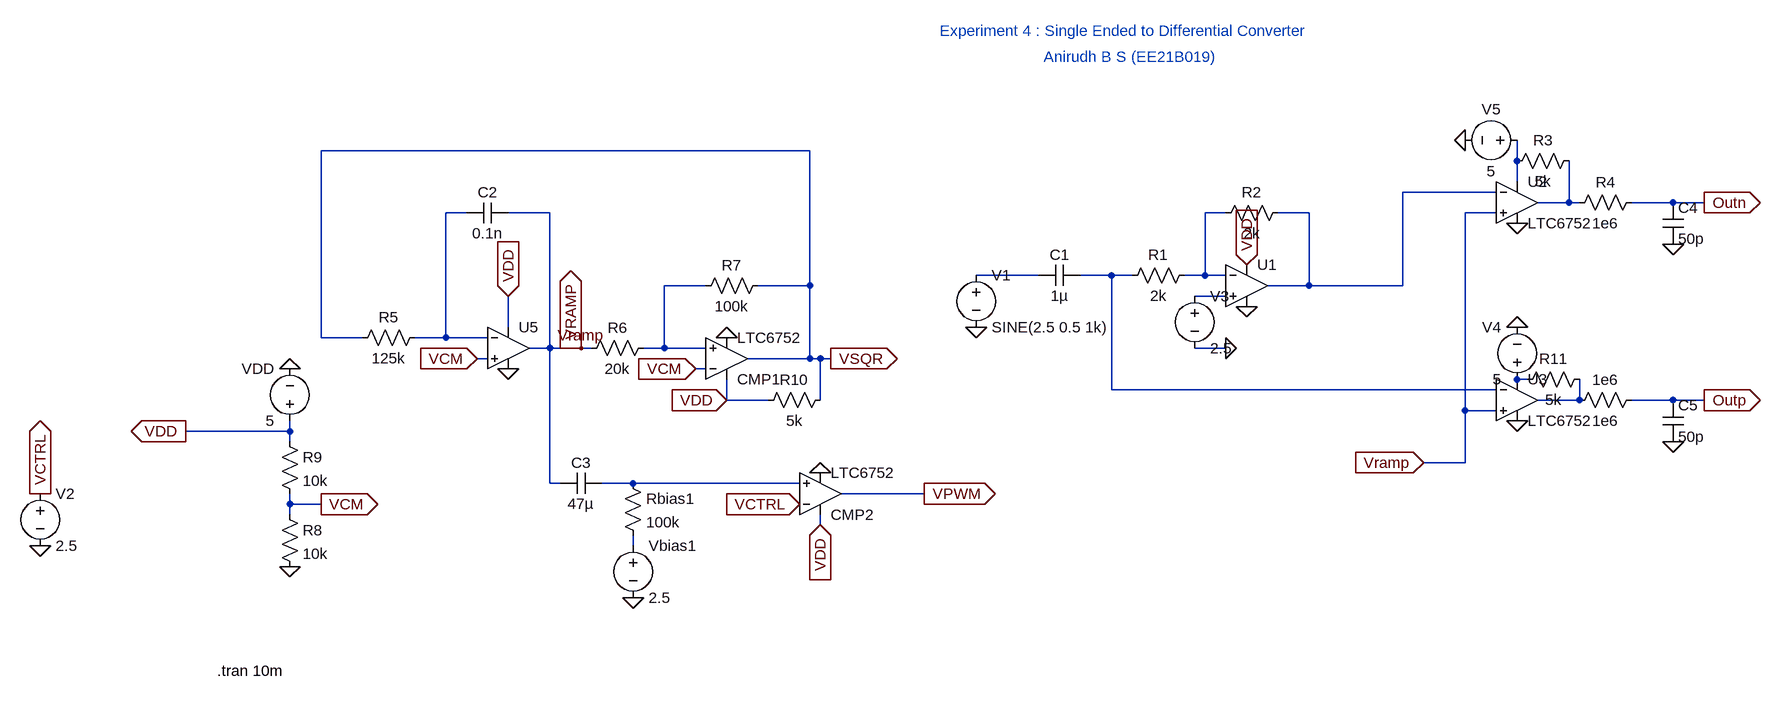
[diagram p0: schematic Experiment 4.asc]
Experiment 4.asc, the LTspice schematic file:
Version 4
SHEET 1 1592 796
WIRE -368 -48 -1120 -48
WIRE 720 -32 720 -64
WIRE 720 0 720 -32
WIRE 688 16 544 16
WIRE 800 32 800 -32
WIRE 800 32 752 32
WIRE 816 32 800 32
WIRE 960 32 896 32
WIRE 1008 32 960 32
WIRE -896 48 -928 48
WIRE -768 48 -832 48
WIRE 272 48 240 48
WIRE 400 48 352 48
WIRE 688 48 640 48
WIRE -16 144 -112 144
WIRE 96 144 48 144
WIRE 128 144 96 144
WIRE 240 144 240 48
WIRE 240 144 208 144
WIRE 272 144 240 144
WIRE -528 160 -592 160
WIRE -368 160 -368 -48
WIRE -368 160 -448 160
WIRE 400 160 400 48
WIRE 400 160 336 160
WIRE 544 160 544 16
WIRE 544 160 400 160
WIRE 272 176 224 176
WIRE -832 224 -832 176
WIRE -1120 240 -1120 -48
WIRE -1056 240 -1120 240
WIRE -928 240 -928 48
WIRE -928 240 -976 240
WIRE -864 240 -928 240
WIRE -768 256 -768 48
WIRE -768 256 -800 256
WIRE -736 256 -768 256
WIRE -720 256 -736 256
WIRE -704 256 -720 256
WIRE -592 256 -592 160
WIRE -592 256 -624 256
WIRE -528 256 -592 256
WIRE 272 256 224 256
WIRE -864 272 -880 272
WIRE -368 272 -368 160
WIRE -368 272 -464 272
WIRE -352 272 -368 272
WIRE -336 272 -352 272
WIRE -528 288 -544 288
WIRE 736 304 720 304
WIRE 96 320 96 144
WIRE 688 320 96 320
WIRE -496 336 -496 304
WIRE -432 336 -496 336
WIRE -352 336 -352 272
WIRE 816 336 816 304
WIRE 816 336 752 336
WIRE 960 336 896 336
WIRE 1008 336 960 336
WIRE 640 352 640 48
WIRE 688 352 640 352
WIRE -1168 384 -1168 368
WIRE -1168 384 -1328 384
WIRE -1168 400 -1168 384
WIRE 640 432 640 352
WIRE 640 432 576 432
WIRE -768 464 -768 256
WIRE -752 464 -768 464
WIRE -640 464 -688 464
WIRE -384 464 -640 464
WIRE -192 480 -320 480
WIRE -1168 496 -1168 480
WIRE -1120 496 -1168 496
WIRE -1168 512 -1168 496
WIRE -352 528 -352 512
WIRE -640 560 -640 544
FLAG -1168 592 0
FLAG -1120 496 VCM
IOPIN -1120 496 Out
FLAG -1168 288 0
FLAG -880 272 VCM
IOPIN -880 272 In
FLAG -544 288 VCM
IOPIN -544 288 In
FLAG -832 288 0
FLAG -496 240 0
FLAG -352 448 0
FLAG -640 640 0
FLAG -1328 384 VDD
IOPIN -1328 384 Out
FLAG -832 176 VDD
IOPIN -832 176 In
FLAG -496 336 VDD
IOPIN -496 336 In
FLAG -352 528 VDD
IOPIN -352 528 In
FLAG -336 272 VSQR
IOPIN -336 272 Out
FLAG -192 480 VPWM
IOPIN -192 480 Out
FLAG -720 256 Vramp
FLAG -1552 480 VCTRL
IOPIN -1552 480 Out
FLAG -384 496 VCTRL
IOPIN -384 496 In
FLAG -736 256 VRAMP
IOPIN -736 256 Out
FLAG -1552 560 0
FLAG 576 432 Vramp
IOPIN 576 432 In
FLAG 720 64 0
FLAG 720 368 0
FLAG 960 96 0
FLAG 272 256 0
FLAG 720 224 0
FLAG 640 -64 0
FLAG 960 400 0
FLAG -112 224 0
FLAG 1008 336 Outp
IOPIN 1008 336 Out
FLAG 1008 32 Outn
IOPIN 1008 32 Out
FLAG 304 128 VDD
IOPIN 304 128 In
FLAG 304 192 0
SYMBOL cap 48 128 R90
WINDOW 0 0 32 VBottom 2
WINDOW 3 32 32 VTop 2
SYMATTR InstName C1
SYMATTR Value 1µ
SYMBOL res 224 128 R90
WINDOW 0 0 56 VBottom 2
WINDOW 3 32 56 VTop 2
SYMATTR InstName R1
SYMATTR Value 2k
SYMBOL res 368 32 R90
WINDOW 0 0 56 VBottom 2
WINDOW 3 32 56 VTop 2
SYMATTR InstName R2
SYMATTR Value 2k
SYMBOL res -960 224 R90
WINDOW 0 0 56 VBottom 2
WINDOW 3 32 56 VTop 2
SYMATTR InstName R5
SYMATTR Value 125k
SYMBOL cap -832 32 R90
WINDOW 0 0 32 VBottom 2
WINDOW 3 32 32 VTop 2
SYMATTR InstName C2
SYMATTR Value 0.1n
SYMBOL cap -688 448 R90
WINDOW 0 0 32 VBottom 2
WINDOW 3 32 32 VTop 2
SYMATTR InstName C3
SYMATTR Value 47µ
SYMBOL res -656 448 R0
SYMATTR InstName Rbias1
SYMATTR Value 100k
SYMBOL res -608 240 R90
WINDOW 0 0 56 VBottom 2
WINDOW 3 32 56 VTop 2
SYMATTR InstName R6
SYMATTR Value 20k
SYMBOL Comparators\\LTC6752 -496 336 M180
SYMATTR InstName CMP1
SYMBOL Comparators\\LTC6752 -352 544 M180
SYMATTR InstName CMP2
SYMBOL res -432 144 R90
WINDOW 0 0 56 VBottom 2
WINDOW 3 32 56 VTop 2
SYMATTR InstName R7
SYMATTR Value 100k
SYMBOL res -1184 496 R0
SYMATTR InstName R8
SYMATTR Value 10k
SYMBOL res -1184 384 R0
SYMATTR InstName R9
SYMATTR Value 10k
SYMBOL voltage -1168 384 R180
WINDOW 0 24 96 Left 2
WINDOW 3 24 16 Left 2
WINDOW 123 0 0 Left 0
WINDOW 39 0 0 Left 0
SYMATTR InstName VDD
SYMATTR Value 5
SYMBOL voltage -640 544 R0
WINDOW 123 0 0 Left 0
WINDOW 39 0 0 Left 0
SYMATTR InstName Vbias1
SYMATTR Value 2.5
SYMBOL res -336 320 R90
WINDOW 0 0 56 VBottom 2
WINDOW 3 32 56 VTop 2
SYMATTR InstName R10
SYMATTR Value 5k
SYMBOL voltage -1552 464 R0
WINDOW 123 0 0 Left 0
WINDOW 39 0 0 Left 0
SYMATTR InstName V2
SYMATTR Value 2.5
SYMBOL voltage -112 128 R0
WINDOW 123 0 0 Left 0
WINDOW 39 0 0 Left 0
SYMATTR InstName V1
SYMATTR Value SINE(2.5 0.5 1k)
SYMBOL Comparators\\LTC6752 720 -32 R0
SYMATTR InstName U2
SYMBOL Comparators\\LTC6752 720 272 R0
SYMATTR InstName U3
SYMBOL res 816 -48 R90
WINDOW 0 0 56 VBottom 2
WINDOW 3 32 56 VTop 2
SYMATTR InstName R3
SYMATTR Value 5k
SYMBOL res 912 16 R90
WINDOW 0 0 56 VBottom 2
WINDOW 3 32 56 VTop 2
SYMATTR InstName R4
SYMATTR Value 1e6
SYMBOL cap 944 32 R0
SYMATTR InstName C4
SYMATTR Value 50p
SYMBOL voltage 224 160 R0
WINDOW 123 0 0 Left 0
WINDOW 39 0 0 Left 0
SYMATTR InstName V3
SYMATTR Value 2.5
SYMBOL voltage 720 320 R180
WINDOW 0 24 96 Left 2
WINDOW 3 24 16 Left 2
WINDOW 123 0 0 Left 0
WINDOW 39 0 0 Left 0
SYMATTR InstName V4
SYMATTR Value 5
SYMBOL voltage 736 -64 R90
WINDOW 0 -32 56 VBottom 2
WINDOW 3 32 56 VTop 2
SYMATTR InstName V5
SYMATTR Value 5
SYMBOL res 912 320 R90
WINDOW 0 0 56 VBottom 2
WINDOW 3 32 56 VTop 2
SYMATTR InstName 1e6
SYMATTR Value 1e6
SYMBOL cap 944 336 R0
SYMATTR InstName C5
SYMATTR Value 50p
SYMBOL OpAmps\\UniversalOpAmp1 -832 256 R0
SYMATTR InstName U5
SYMBOL OpAmps\\UniversalOpAmp1 304 160 R0
SYMATTR InstName U1
SYMBOL res 832 288 R90
WINDOW 0 0 56 VBottom 2
WINDOW 3 32 56 VTop 2
SYMATTR InstName R11
SYMATTR Value 5k
TEXT -1280 752 Left 2 !.tran 10m
TEXT -168 -232 Left 2 ;Experiment 4 : Single Ended to Differential Converter
TEXT -8 -192 Left 2 ;Anirudh B S (EE21B019)

The netlist it stands for:
* Experiment 4.asc
C1 N007 N006 1µ
R1 N005 N007 2k
R2 N002 N005 2k
R5 N004 VSQR 125k
C2 Vramp N004 0.1n
C3 N012 Vramp 47µ
Rbias1 N012 N013 100k
R6 N008 Vramp 20k
XCMP1 N008 VCM VDD 0 VSQR LTC6752  ; pins In+ In- V+ V- OUT
XCMP2 N012 VCTRL VDD 0 VPWM LTC6752  ; pins In+ In- V+ V- OUT
R7 VSQR N008 100k
R8 VCM 0 10k
R9 VDD VCM 10k
VDD VDD 0 5
Vbias1 N013 0 2.5
R10 VSQR VDD 5k
V2 VCTRL 0 2.5
V1 N006 0 SINE(2.5 0.5 1k)
XU2 Vramp N002 N001 0 N003 LTC6752  ; pins In+ In- V+ V- OUT
XU3 Vramp N007 N010 0 N011 LTC6752  ; pins In+ In- V+ V- OUT
R3 N003 N001 5k
R4 Outn N003 1e6
C4 Outn 0 50p
V3 N009 0 2.5
V4 N010 0 5
V5 N001 0 5
R§1e6 Outp N011 1e6
C5 Outp 0 50p
XU5 VCM N004 VDD 0 Vramp level1 Avol=1Meg GBW=10Meg Vos=0 En=0 Enk=0 In=0 Ink=0 Rin=500Meg  ; pins In+ In- V+ V- OUT
XU1 N009 N005 VDD 0 N002 level1 Avol=1Meg GBW=10Meg Vos=0 En=0 Enk=0 In=0 Ink=0 Rin=500Meg  ; pins In+ In- V+ V- OUT
R11 N011 N010 5k
.tran 10m
* Experiment 4 : Single Ended to Differential Converter
* Anirudh B S (EE21B019)
.lib LTC7.lib
.lib UniversalOpAmp1.lib
.backanno
.end